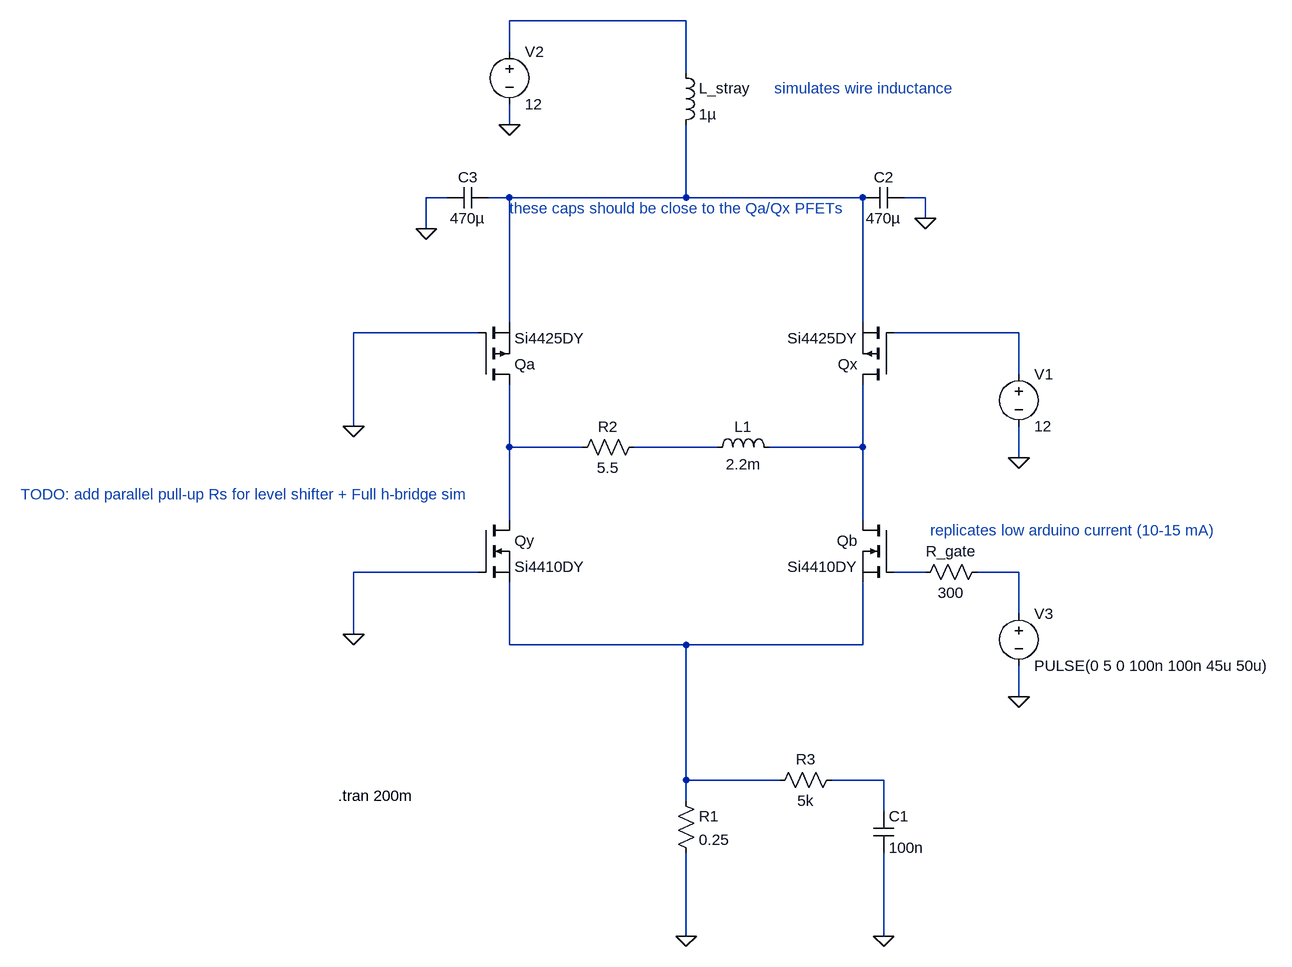
[diagram p0: schematic h_bridge.asc]
h_bridge.asc, the LTspice schematic file:
Version 4.1
SHEET 1 1708 1108
WIRE 752 -320 480 -320
WIRE 480 -272 480 -320
WIRE 752 -240 752 -320
WIRE 480 -160 480 -192
WIRE 384 -48 352 -48
WIRE 480 -48 448 -48
WIRE 752 -48 752 -160
WIRE 752 -48 480 -48
WIRE 1024 -48 752 -48
WIRE 1120 -48 1088 -48
WIRE 1120 -16 1120 -48
WIRE 352 0 352 -48
WIRE 480 144 480 -48
WIRE 1024 144 1024 -48
WIRE 432 160 240 160
WIRE 1264 160 1072 160
WIRE 1264 224 1264 160
WIRE 240 304 240 160
WIRE 480 336 480 240
WIRE 592 336 480 336
WIRE 800 336 672 336
WIRE 1024 336 1024 240
WIRE 1024 336 880 336
WIRE 1264 352 1264 304
WIRE 480 448 480 336
WIRE 1024 448 1024 336
WIRE 432 528 240 528
WIRE 1120 528 1072 528
WIRE 1264 528 1200 528
WIRE 1264 592 1264 528
WIRE 240 624 240 528
WIRE 480 640 480 544
WIRE 752 640 480 640
WIRE 1024 640 1024 544
WIRE 1024 640 752 640
WIRE 1264 720 1264 672
WIRE 752 848 752 640
WIRE 896 848 752 848
WIRE 1056 848 976 848
WIRE 752 880 752 848
WIRE 1056 896 1056 848
WIRE 752 1088 752 960
WIRE 1056 1088 1056 960
FLAG 480 -160 0
FLAG 240 304 0
FLAG 240 624 0
FLAG 1264 352 0
FLAG 1264 720 0
FLAG 752 1088 0
FLAG 1056 1088 0
FLAG 1120 -16 0
FLAG 352 0 0
SYMBOL voltage 480 -288 R0
WINDOW 123 0 0 Left 0
WINDOW 39 0 0 Left 0
SYMATTR InstName V2
SYMATTR Value 12
SYMBOL nmos 432 448 R0
SYMATTR InstName Qy
SYMATTR Value Si4410DY
SYMBOL nmos 1072 448 M0
SYMATTR InstName Qb
SYMATTR Value Si4410DY
SYMBOL voltage 1264 208 R0
WINDOW 123 0 0 Left 0
WINDOW 39 0 0 Left 0
SYMATTR InstName V1
SYMATTR Value 12
SYMBOL voltage 1264 576 R0
WINDOW 123 0 0 Left 0
WINDOW 39 0 0 Left 0
SYMATTR InstName V3
SYMATTR Value PULSE(0 5 0 100n 100n 45u 50u)
SYMBOL pmos 1072 240 R180
SYMATTR InstName Qx
SYMATTR Value Si4425DY
SYMBOL pmos 432 240 M180
SYMATTR InstName Qa
SYMATTR Value Si4425DY
SYMBOL res 688 320 R90
WINDOW 0 0 56 VBottom 2
WINDOW 3 32 56 VTop 2
SYMATTR InstName R2
SYMATTR Value 5.5
SYMBOL ind 784 352 R270
WINDOW 0 32 56 VTop 2
WINDOW 3 5 56 VBottom 2
SYMATTR InstName L1
SYMATTR Value 2.2m
SYMATTR SpiceLine Rser=1m
SYMBOL res 736 864 R0
SYMATTR InstName R1
SYMATTR Value 0.25
SYMBOL res 992 832 R90
WINDOW 0 0 56 VBottom 2
WINDOW 3 32 56 VTop 2
SYMATTR InstName R3
SYMATTR Value 5k
SYMBOL cap 1040 896 R0
SYMATTR InstName C1
SYMATTR Value 100n
SYMBOL res 1216 512 R90
WINDOW 0 0 56 VBottom 2
WINDOW 3 32 56 VTop 2
SYMATTR InstName R_gate
SYMATTR Value 300
SYMBOL ind 736 -256 R0
SYMATTR InstName L_stray
SYMATTR Value 1µ
SYMATTR SpiceLine Rser=1m
SYMBOL cap 1088 -64 R90
WINDOW 0 0 32 VBottom 2
WINDOW 3 32 32 VTop 2
SYMATTR InstName C2
SYMATTR Value 470µ
SYMBOL cap 448 -64 R90
WINDOW 0 0 32 VBottom 2
WINDOW 3 32 32 VTop 2
SYMATTR InstName C3
SYMATTR Value 470µ
TEXT 216 872 Left 2 !.tran 200m
TEXT 888 -216 Left 2 ;simulates wire inductance
TEXT 1128 464 Left 2 ;replicates low arduino current (10-15 mA)
TEXT 480 -32 Left 2 ;these caps should be close to the Qa/Qx PFETs
TEXT -272 408 Left 2 ;TODO: add parallel pull-up Rs for level shifter + Full h-bridge sim

The netlist it stands for:
* h_bridge.asc
V2 N001 0 12
M§Qy N004 0 N009 N009 Si4410DY
M§Qb N006 N007 N009 N009 Si4410DY
V1 N003 0 12
V3 N008 0 PULSE(0 5 0 100n 100n 45u 50u)
M§Qx N006 N003 N002 N002 Si4425DY
M§Qa N004 0 N002 N002 Si4425DY
R2 N005 N004 5.5
L1 N005 N006 2.2m Rser=1m
R1 N009 0 0.25
R3 N010 N009 5k
C1 N010 0 100n
R_gate N008 N007 300
L_stray N001 N002 1µ Rser=1m
C2 0 N002 470µ
C3 N002 0 470µ
.model NMOS NMOS
.model PMOS PMOS
.lib standard.mos
.tran 200m
* simulates wire inductance
* replicates low arduino current (10-15 mA)
* these caps should be close to the Qa/Qx PFETs
* TODO: add parallel pull-up Rs for level shifter + Full h-bridge sim
.backanno
.end